# Altium project Lion-IRVT.PrjPcb (part 8 of 8)

## Sheet LionIRVT-Power.SchDoc
size A3
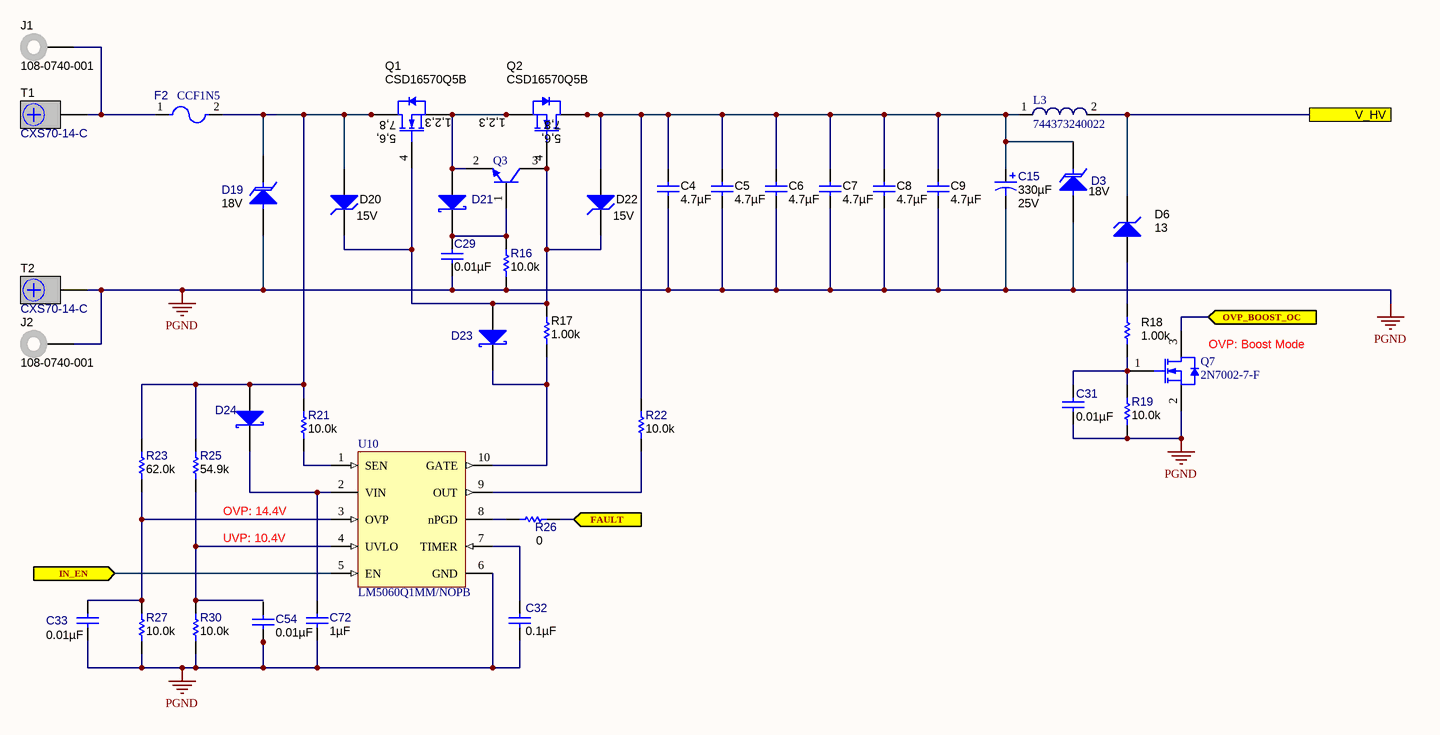
[diagram p7: LionIRVT-Power.SchDoc]

### Parts
C4  ValueDisplayed: 4.7µF  [2220_280]  (hidden comment: C5750X7R2A475M230KA)
C5  ValueDisplayed: 4.7µF  [2220_280]  (hidden comment: C5750X7R2A475M230KA)
C6  ValueDisplayed: 4.7µF  [2220_280]  (hidden comment: C5750X7R2A475M230KA)
C7  ValueDisplayed: 4.7µF  [2220_280]  (hidden comment: C5750X7R2A475M230KA)
C8  ValueDisplayed: 4.7µF  [2220_280]  (hidden comment: C5750X7R2A475M230KA)
C9  ValueDisplayed: 4.7µF  [2220_280]  (hidden comment: C5750X7R2A475M230KA)
C15  ValueDisplayed: 330µF  Value2: 25V  [CAPSMT_62_F12]  (hidden comment: 25SVPF330M)
C29  ValueDisplayed: 0.01µF  [0603C]  (hidden comment: GRM1885C1H103JA01D)
C31  ValueDisplayed: 0.01µF  [0603C]  (hidden comment: GRM1885C1H103JA01D)
C32  ValueDisplayed: 0.1µF  [0603C]  (hidden comment: C0603C104J3RACTU)
C33  ValueDisplayed: 0.01µF  [0603C]  (hidden comment: GRM1885C1H103JA01D)
C54  ValueDisplayed: 0.01µF  [0603C]  (hidden comment: GRM1885C1H103JA01D)
C72  ValueDisplayed: 1µF  [0603C]  (hidden comment: C0603C105K3RACTU)
D3  value 18V  [SMA]  (hidden comment: SMAJ18A)
D6  value 13  [sod-323]  (hidden comment: MMSZ5243BS-7-F)
D19  value 18V  [SMA]  (hidden comment: SMAJ18A)
D20  value 15V  [sod-323]  (hidden comment: MMSZ5245BS-7-F)
D21  NSR0240V2T1G  [SOD-523]  (value not drawn)
D22  value 15V  [sod-323]  (hidden comment: MMSZ5245BS-7-F)
D23  NSR0240V2T1G  [SOD-523]  (value not drawn)
D24  NSR0240V2T1G  [SOD-523]  (value not drawn)
F2  CCF1N5  [FUSE_CCF]
J1  108-0740-001  [Johnson_108-0740-001]
J2  108-0740-001  [Johnson_108-0740-001]
L3  744373240022  [WE-LHMI 4020]
Q1  CSD16570Q5B  [DNK8]
Q2  CSD16570Q5B  [DNK8]
Q3  MMBT2222ALT1G  [ONSC-SOT-23-3-318-08_V]  (value not drawn)
Q7  2N7002-7-F  [DIOD-SOT23-3_V]
R16  ValueDisplayed: 10.0k  [0603R]  (hidden comment: RC0603FR-0710KL)
R17  ValueDisplayed: 1.00k  [0603R]  (hidden comment: Resistor)
R18  ValueDisplayed: 1.00k  [0603R]  (hidden comment: Resistor)
R19  ValueDisplayed: 10.0k  [0603R]  (hidden comment: RC0603FR-0710KL)
R21  ValueDisplayed: 10.0k  [0603R]  (hidden comment: RC0603FR-0710KL)
R22  ValueDisplayed: 10.0k  [0603R]  (hidden comment: RC0603FR-0710KL)
R23  ValueDisplayed: 62.0k  [0603R]  (hidden comment: RC0603FR-0762KL)
R25  ValueDisplayed: 54.9k  [0603R]  (hidden comment: RC0603FR-0754K9L)
R26  ValueDisplayed: 0  [0603R]  (hidden comment: RC0603JR-070RL)
R27  ValueDisplayed: 10.0k  [0603R]  (hidden comment: RC0603FR-0710KL)
R30  ValueDisplayed: 10.0k  [0603R]  (hidden comment: RC0603FR-0710KL)
T1  CXS70-14-C  [Panduit_CXS70-14-C]
T2  CXS70-14-C  [Panduit_CXS70-14-C]
U10  LM5060Q1MM/NOPB  [DGS0010A_N]

### Ports
FAULT (in), IN_EN (in), OVP_BOOST_OC (in), V_HV

### Nets
PGND: C4.2 C5.2 C6.2 C7.2 C8.2 C9.2 C15.2(-) C29.2 C31.1 C32.1 C33.1 C54.1 C72.2 D3.2(A) D19.2(A) J2.1 Q7.2(S) R16.2 R19.2 R27.2 R30.2 T2.1 U10.6(GND)
V_HV: D6.1(K) L3.2 ; port V_HV
FAULT: R26.1 ; port FAULT
IN_EN: U10.5(EN) ; port IN_EN
NetC4_1: C4.1 C5.1 C6.1 C7.1 C8.1 C9.1 C15.1(+) D3.1(K) D22.2(A) L3.1 Q2.5(D) Q2.6(D) Q2.7(D) Q2.8(D) R22.1
NetC29_1: C29.1 D21.1(K) Q3.1(B) R16.1
NetC31_2: C31.2 Q7.1(G) R18.1 R19.1
NetC32_2: C32.2 U10.7(TIMER)
NetC33_2: C33.2 R23.1 R27.1 U10.3(OVP)
NetC72_1: C72.1 D24.1(K) U10.2(VIN)
NetD6_2: D6.2(A) R18.2
NetD10A_1: Q7.3(D) ; port OVP_BOOST_OC
NetD19_1: D19.1(K) D20.2(A) D24.2(A) F2.2 Q1.5(D) Q1.6(D) Q1.7(D) Q1.8(D) R21.1 R23.2 R25.2
NetD20_1: D20.1(K) D22.1(K) D23.2(A) Q1.4(G) Q2.4(G) Q3.3(C) R17.2
NetD21_2: D21.2(A) Q1.1(S) Q1.2(S) Q1.3(S) Q2.1(S) Q2.2(S) Q2.3(S) Q3.2(E)
NetD23_1: D23.1(K) R17.1 U10.10(GATE)
NetF2_1: F2.1 J1.1 T1.1
NetR21_2: R21.2 U10.1(SEN)
NetR22_2: R22.2 U10.9(OUT)
NetR25_1: R25.1 R30.1 U10.4(UVLO)
NetR26_2: R26.2 U10.8(nPGD)

Not connected (* = marked no-connect by the designer): C54 2

### Notes on the sheet
- (near Q7) OVP: Boost Mode
- (near R25) OVP: 14.4V
- UVP: 10.4V
- Title
- Size:
- Date:
- A3
- Number:
- Time:
- Revision:
- Sheet
- of
- File:
- (in symbol CSD16570Q5B) 7,8; 1,2,3; 5,6,

### Library data of the parts
C4-C9 = C5750X7R2A475M230KA: CAP, CERM, 4.7 µF, 100 V, +/- 20%, X7R, 2220; Manufacturer: TDK; Polarized: N; CompType: Capacitor; Value: 4.7uF; U/M: EA; Cap_F: 0.0000047; Tolerance_%: 20; ESR_ohm: 0.0015; Value1: 0.0015 ohm; VDC_V: 100; Value2: 100V; IRMS_A: 5.5; TaMin_C: -55; TaMax_C: 125; Cap_Case: 2220; AEC Category: Q200; SymbolVersion: 2008-07-09; PartNumber: C5750X7R2A475M230KA; PackageReference: 2220; RoHS: Y; MountType: SMT; Technology: Ceramic; TempCo: X7R; Published: 2008-06-19; Publisher: Texas Instruments; LatestRevisionDate: 2016-03-26; ComponentLink1Description: Datasheet link; ComponentLink1URL: http://www.tdk.co.jp/tefe02/e412_c.pdf; Supplier 1: Digi-Key; Supplier Part Number 1: 445-1450-1-ND; Supplier 2: Mouser; Supplier Part Number 2: 810-C5750X7R2A475M; Supplier 3: Farnell; Supplier Part Number 3: 1843193; AEC Qualified: N; AEC Grade: N/A
C15 = 25SVPF330M: CAP, Aluminum Polymer, 330 µF, 25 V, +/- 20%, 0.014 ohm, F12, SMD, 2-Leads, Body 10.5x10.5mm, Height 12.7mm SMD; Manufacturer: Panasonic; Polarized: Y; CompType: Capacitor; Value: 330uF; U/M: EA; Cap_F: 0.00033; Tolerance_%: 20; VDC_V: 25; ESR_ohm: 0.014; IRMS_A: 5; TaMin_C: -55; TaMax_C: 105; SizeAreaWB_mm2: 151.29; SizeArea_mm2: 106.09; SizeX_mm: 10.3; SizeZ_mm: 12.6; AEC Category: Q200; AEC Qualified: N; SymbolVersion: 2008-07-09; PartNumber: 25SVPF330M; PackageReference: F12, SMD, 2-Leads, Body 10.5x10.5mm, Height 12.7mm; RoHS: Y; Value1: 0.014 ohm; MountType: SMT; Technology: Aluminum Polymer; Series: SVPF; Cap_Case: F12; SizeY_mm: 10.3; Publisher: Texas Instruments; LatestRevisionDate: 2016-12-22; ComponentLink1Description: Datasheet link; ComponentLink1URL: http://industrial.panasonic.com/www-data/pdf/AAB8000/AAB8000CE1.pdf; AEC Grade: N/A
C29 C31 C33 C54 = GRM1885C1H103JA01D: CAP, CERM, 0.01 µF, 50 V, +/- 5%, C0G/NP0, 0603; Manufacturer: MuRata; Polarized: N; CompType: Capacitor; Value: 0.01uF; U/M: EA; Cap_F: 0.00000001; Tolerance_%: 5; Value1: Unknown; VDC_V: 50; Value2: 50V; TaMin_C: -55; TaMax_C: 125; Cap_Case: 0603; SizeArea_mm2: 1.28; SizeAreaWB_mm2: 4.68; SizeX_mm: 1.6; SizeY_mm: 0.8; SizeZ_mm: 1; AEC Category: Q200; SymbolVersion: 2008-07-09; PartNumber: GRM1885C1H103JA01D; PackageReference: 0603; RoHS: Y; MountType: SMT; Technology: Ceramic; TempCo: C0G/NP0; Published: 2008-06-19; Publisher: Texas Instruments; LatestRevisionDate: 2017-03-17; ComponentLink1Description: Datasheet link; ComponentLink1URL: http://search.murata.co.jp/Ceramy/image/img/A01X/G101/ENG/GRM1885C1H103JA01-01.pdf; Supplier 1: Digi-Key; Supplier Part Number 1: 490-9666-1-ND; Supplier 2: Newark; Supplier Part Number 2: 31Y1764; Supplier 3: Mouser; Supplier Part Number 3: 81-GRM1885C1H103JA1D; AEC Qualified: N; AEC Grade: N/A
C32 = C0603C104J3RACTU: CAP, CERM, 0.1 µF, 25 V, +/- 5%, X7R, 0603; Manufacturer: Kemet; Polarized: N; CompType: Capacitor; Value: 0.1uF; U/M: EA; Cap_F: 0.0000001; Tolerance_%: 5; Value1: Unknown; VDC_V: 25; Value2: 25V; TaMin_C: -55; TaMax_C: 125; Cap_Case: 0603; SizeArea_mm2: 1.28; SizeAreaWB_mm2: 4.68; SizeX_mm: 1.6; SizeY_mm: 0.8; SizeZ_mm: 1; AEC Category: Q200; SymbolVersion: 2008-07-09; PartNumber: C0603C104J3RACTU; PackageReference: 0603; RoHS: Y; MountType: SMT; Technology: Ceramic; TempCo: X7R; Published: 2008-06-19; Publisher: Texas Instruments; LatestRevisionDate: 2016-09-23; ComponentLink1Description: Datasheet link; ComponentLink1URL: http://www.kemet.com/kemet/web/homepage/kechome.nsf/vapubfiles/F3102_Y5V.pdf/$file/F3102_Y5V.pdf; Supplier 1: Digi-Key; Supplier Part Number 1: 399-1282-1-ND; Supplier 2: Mouser; Supplier Part Number 2: 80-C0603C104J3R; Supplier 3: Farnell; Supplier Part Number 3: 1650833; AEC Qualified: ?
C72 = C0603C105K3RACTU: CAP, CERM, 1 µF, 25 V, +/- 10%, X7R, 0603; Manufacturer: Kemet; Polarized: N; CompType: Capacitor; Value: 1uF; U/M: EA; Cap_F: 0.000001; Tolerance_%: 10; Value1: Unknown; VDC_V: 25; Value2: 25V; TaMin_C: -55; TaMax_C: 125; Cap_Case: 0603; SizeArea_mm2: 1.28; SizeAreaWB_mm2: 4.68; SizeX_mm: 1.6; SizeY_mm: 0.8; SizeZ_mm: 1; AEC Category: Q200; SymbolVersion: 2008-07-09; PartNumber: C0603C105K3RACTU; PackageReference: 0603; RoHS: Y; MountType: SMT; Technology: Ceramic; TempCo: X7R; Published: 2008-06-19; Publisher: Texas Instruments; LatestRevisionDate: 2016-09-23; ComponentLink1Description: Datasheet link; ComponentLink1URL: http://capacitoredge.kemet.com/capedge2/DataSheet/Datasheet-C0603C105K3RACTU.pdf?pn=C0603C105K3RACTU; Supplier 1: Digi-Key; Supplier Part Number 1: 399-7376-1-ND; Supplier 2: Mouser; Supplier Part Number 2: 80-C0603C105K3R; Supplier 3: Farnell; Supplier Part Number 3: 2118128; AEC Qualified: ?
D3 D19 = SMAJ18A: Diode, TVS, Uni, 18 V, 29.2 Vc, SMA; Manufacturer: Littelfuse; U/M: EA; Value1: 3.3W; Vr_V: 18; Power_W: 3.3; RJA_CperW: 120; AEC Category: Q101; AEC Qualified: N; SizeAreaWB_mm2: 37.3428; SizeArea_mm2: 16.3228; SizeX_mm: 5.59; SizeY_mm: 2.92; SizeZ_mm: 2.87; CompType: TVS; SymbolVersion: 2012-01-13; PartNumber: SMAJ18A; PackageReference: SMA; MountType: SMT; RoHS: Y; Published: 2008-10-08; Publisher: Texas Instruments; LatestRevisionDate: 2016-12-21; ComponentLink1Description: Datasheet link; ComponentLink1URL: http://www.littelfuse.com/~/media/electronics/datasheets/tvs_diodes/littelfuse_tvs_diode_smaj_datasheet.pdf.pdf; Supplier 1: Digi-Key; Supplier Part Number 1: SMAJ18ALFCT-ND; Supplier 2: Mouser; Supplier Part Number 2: 576-SMAJ18A; Supplier 3: Farnell; Supplier Part Number 3: 1787557; Vz_V: N/A; LatestRevisionNote: Updated Supplier Data
D6 = MMSZ5243BS-7-F: Diode, Zener, 13V, 200mW, SOD-323; Manufacturer: Diodes Inc.; U/M: EA; Power_W: 0.2; Value1: 0.2W; RJA_CperW: 350; CompType: Zener; SymbolVersion: 2010-08-25; PartNumber: MMSZ5243BS-7-F; PackageReference: SOD-323; Vr_V: N/A; Vz_V: 13; MountType: SMT; RoHS: Y; ComponentLink1Description: Datasheet link; ComponentLink1URL: http://www.diodes.com/datasheets/ds31038.pdf; Published: 2008-10-08; Publisher: Texas Instruments; LatestRevisionDate: 2013-07-05; LatestRevisionNote: Updated Supplier Data
D20 D22 = MMSZ5245BS-7-F: Diode, Zener, 15 V, 200 mW, SOD-323; Manufacturer: Diodes Inc.; SymbolCreator: a0412235; U/M: EA; Power_W: 0.2; Vz_V: 15; Value1: 0.2W; RJA_CperW: 350; SizeAreaWB_mm2: 8.695; SizeArea_mm2: 3.645; SizeX_mm: 2.7; SizeY_mm: 1.35; SizeZ_mm: 1; AEC Category: Q101; SymbolVersion: 2010-08-25; PartNumber: MMSZ5245BS-7-F; PackageReference: SOD-323; CompType: Zener; Vr_V: N/A; MountType: SMT; RoHS: Y; ComponentLink1Description: Datasheet link; ComponentLink1URL: http://www.diodes.com/datasheets/ds31038.pdf; Published: 2008-10-08; Publisher: Texas Instruments; LatestRevisionDate: 2017-03-18; LatestRevisionNote: Updated Supplier Data; Supplier 1: Digi-Key; Supplier Part Number 1: MMSZ5245BS-FDICT-ND; Supplier 2: Mouser; Supplier Part Number 2: 621-MMSZ5245BS-F; AEC Qualified: ?
D21 D23 D24 = NSR0240V2T1G: Diode, Schottky, 40V, 0.25A, SOD-523; Manufacturer: ON Semiconductor; U/M: EA; Vf_V: 0.7; Value2: 0.7V; Io_A: 0.25; Vr_V: 40; TJmax_C: 150; RJC_CperW: 600; CompType: Diode; SymbolVersion: 2008-12-08; PartNumber: NSR0240V2T1G; PackageReference: SOD-523; Value: 40V; Value1: 0.25A; MountType: SMT; Type: Schottky; RoHS: Y; Published: 2008-06-26; Publisher: Texas Instruments; LatestRevisionDate: 2014-07-21; ComponentLink1Description: Datasheet link; ComponentLink1URL: http://www.onsemi.com/pub_link/Collateral/NSR0240V2T1-D.PDF; Supplier 1: Digi-Key; Supplier Part Number 1: NSR0240V2T1GOSCT-ND; Supplier 2: Mouser; Supplier Part Number 2: 863-NSR0240V2T1G; Supplier 3: Newark; Supplier Part Number 3: 46P8323
F2 = FUSE_CCF1N_SERIES: Fuse, Fast Acting, 50VDC, 20A; Manufacturer: Koanet; Area: 46035; Value: LH-10; ComponentLink1URL: \\vette02\pmp_pcb\pcad_pdf's\ccf_fuse.pdf; ComponentHeight: 0.098 inch; PackageReference: 0.98 x 0.236 inch; SymbolVersion: 07/31/2009 12:17:29; PartNumber: CCF1N5; ComponentLink1Description: AEO Datasheet Link
J1 J2 = 108-0740-001: Standard Banana Jack, Uninsulated, 15A; Manufacturer: Emerson Network Power; SymbolCreator: a0412235; CompType: Connector; U/M: EA; SymbolVersion: 2009-09-23; PartNumber: 108-0740-001; PackageReference: Banana Jack; RoHS: Y; MountType: TH; ComponentLink1Description: Datasheet Link; ComponentLink1URL: http://emersonnetworkpower.com/webapp/wcs/stores/servlet/ESC/resources/1080740001.pdf; Publisher: Texas Instruments; LatestRevisionDate: 2014-11-22; Supplier 1: Digi-Key; Supplier Part Number 1: J147-ND; Supplier 2: Mouser; Supplier Part Number 2: 530-108-0740-1
L3 = CMP-1353-00034-1: SMD Power Inductor WE-LHMI, L=0.22 µH; Manufacturer: Wuerth Elektronik; Inductance: 0.22 ÂµH; ComponentLink1URL: http://www.we-online.com; ComponentLink2Description: Datasheet; PartNumber: 744373240022; PackageReference: WE-LHMI 4020; ComponentLink2URL: http://katalog.we-online.de/kataloge/eisos/media/pdf/744373240022.pdf; ComponentLink1Description: Manufacturer URL
Q1 Q2 = CSD16570Q5B: 25V, N ch NexFET MOSFET™, single SON5x6, 0.82mOhm; Manufacturer: Texas Instruments; Manufacturer Part Number: CSD16570Q5BT; CompType: MOSFET; Continuous Drain Current (ID): 100A; Rds On Max: 0.59mR; Input Capacitance: 14nF; Max Power Dissipation: 195W; Gate to Source Voltage (Vgs): 20V; Fall Time: 72ns; Rise Time: 43ns; Turn-Off Delay Time: 156ns; Turn-On Delay Time: 5ns; Threshold Voltage: 1.5V; Number of Channels: 1; SymbolVersion: 2008-07-09; Value: 25V; PartNumber: CSD16570Q5B; PackageReference: DNK0008A; ComponentLink1Description: Datasheet link; ComponentLink1URL: http://www.ti.com/lit/ds/symlink/csd17308q3.pdf; Supplier 1: Digi-Key; RoHS: Yes; Category: MOSFETs; Stock 1: 3774; Pricing 1: 1=2.43000, 10=2.18600, 25=2.06240, 100=1.60880 (USD); Mount: Surface Mount; Number of Pins: 8; Weight: 0.000847oz; Contact Plating: Gold; Min Operating Temperature: -55°C; Max Operating Temperature: 150°C; Packaging: Tape and Reel; Drain to Source Voltage (Vdss): 25V; Element Configuration: Single; Drain to Source Breakdown Voltage: 25V; Package Quantity: 250; Lead Free: Contains Lead; REACH SVHC: No SVHC; ComponentLink2URL: http://www.farnell.com/datasheets/1874868.pdf?src-supplier=Farnell; ComponentLink2Description: http://www.farnell.com/datasheets/1874868.pdf?src-supplier=Farnell; ComponentLink3URL: http://www.farnell.com/datasheets/2026550.pdf?src-supplier=Element14; ComponentLink3Description: http://www.farnell.com/datasheets/2026550.pdf?src-supplier=Element14; ComponentLink4URL: http://www.ti.com/lit/ds/symlink/csd16570q5b.pdf?src-supplier=Digi-Key; ComponentLink4Description: http://www.ti.com/lit/ds/symlink/csd16570q5b.pdf?src-supplier=Digi-Key; ComponentLink5URL: http://www.ti.com/general/docs/lit/getliterature.tsp?genericPartNumber=CSD16570Q5B&fileType=pdf&src-supplier=Farnell; ComponentLink5Description: http://www.ti.com/general/docs/lit/getliterature.tsp?genericPartNumber=CSD16570Q5B&fileType=pdf&src-supplier=Farnell; ComponentLink6URL: http://www.ti.com/general/docs/lit/getliterature.tsp?genericPartNumber=CSD16570Q5B&&fileType=pdf&src-supplier=Avnet; ComponentLink6Description: http://www.ti.com/general/docs/lit/getliterature.tsp?genericPartNumber=CSD16570Q5B&&fileType=pdf&src-supplier=Avnet; ComponentLink7URL: http://www.farnell.com/datasheets/1874868.pdf?src-supplier=Element14; ComponentLink7Description: http://www.farnell.com/datasheets/1874868.pdf?src-supplier=Element14; ComponentLink8URL: http://www.ti.com/lit/gpn/csd16570q5b?src-supplier=Mouser; ComponentLink8Description: http://www.ti.com/lit/gpn/csd16570q5b?src-supplier=Mouser; Supplier Part Number 1: 296-38335-1-ND
Q3 = CMP-1048-00538-1: General Purpose Transistor, NPN Silicon, 3-Pin SOT-23, Pb-Free, Tape and Reel; Manufacturer: On Semiconductor; fT Min (MHz): 300; IC Continuous (A): 0.6; ComponentLink3URL: http://www.onsemi.cn/pub_link/Collateral/318-08.PDF; PartNumber: MMBT2222ALT1G; RoHS: TRUE; ComponentLink1URL: http://www.onsemi.com/; ComponentLink3Description: Package Specification; ComponentLink2Description: Datasheet; Mounting Technology: Surface Mount; Packing: Tape and Reel; PackageDescription: 3-Pin Small Outline Transistor, Body 2.92 x 1.3 mm, Pitch 0.95 mm; DatasheetVersion: Rev. 10; PackageReference: SOT-23-3-318-08; ComponentLink2URL: http://www.onsemi.cn/pub_link/Collateral/MMBT2222LT1-D.PDF; Polarity: NPN; PackageVersion: Rev. AP, 11/2009; ComponentLink1Description: Manufacturer URL
Q7 = CMP-2000-04929-1: N-Channel Enhancement Mode Field Effect Transistor, 60 V, 0.115 A, -55 to 150 degC, 3-Pin SOT23, RoHS, Tape and Reel; Id - Continuous Drain Current: 115mA; Typical Turn-On Delay Time: 7ns; Typical Turn-Off Delay Time: 11ns; Brand: DiodesIncorporated; Transistor Type: 1N-Channel; Vgs - Gate-Source Voltage: 20V; Rise Time: 3ns; Configuration: Single; Fall Time: 5.6ns; Vds - Drain-Source Breakdown Voltage: 70V; Rds On - Drain-Source Resistance: 7.5Ohms; Number of Channels: 1Channel; Forward Transconductance - Min: 0.08S; Pd - Power Dissipation: 300mW; Unit Weight: 0.000282oz; Datasheet URL: http://datasheet.octopart.com/2N7002-7-F-Diodes-Inc.-datasheet-8326113.pdf; Width: 1.3mm; Series: 2N7002; Length: 2.9mm; Product Category: MOSFET; Minimum Operating Temperature: -55C; Manufacturer URL: http://www.diodes.com/; Mounting Style: SMD/SMT; Package Reference: SOT23-3; Package Description: 3-Pin Small Outline Transistor, Body 2.9 x 1.3 mm, Pitch 0.96 mm; Maximum Operating Temperature: +150C; Transistor Polarity: N-Channel; Factory Pack Quantity: 3000; Technology: Si; Channel Mode: Enhancement; Datasheet Version: Rev. 21-2, 02/2009; Type: EnhancementModeFieldEffectTransistor; RoHS: True; Packaging: Reel; Package / Case: SOT-23-3; Height: 1mm; Product: MOSFETSmallSignal; Manufacturer: DiodesIncorporated
R16 R19 R21 R22 R27 R30 = RC0603FR-0710KL: RES, 10.0 k, 1%, 0.1 W, 0603; Manufacturer: Yageo America; CompType: Resistor; Value: 10.0k; Res_ohm: 10000; Value_Code: 10k0; Tolerance_%: 1; Power_W: 0.1; Value2: 0.1W; VDC_V: 150; TempCo: 200 ppm/C; SizeArea_mm2: 1.28; SizeX_mm: 1.6; SizeY_mm: 0.8; EIA_Code: E96; U/M: EA; AEC Category: Q200; SymbolVersion: 2009-05-29; PartNumber: RC0603FR-0710KL; PackageReference: 0603; RoHS: Y; Value1: 1%; MountType: SMT; Technology: Thick Film; SizeZ_mm: 1; Published: 2008-06-26; Publisher: Texas Instruments; LatestRevisionDate: 2017-03-04; ComponentLink1Description: Datasheet link; ComponentLink1URL: http://www.yageo.com/pdf/Pu-RC0603_51_PbFree_L_2.pdf; Supplier 1: Digi-Key; Supplier Part Number 1: 311-10.0KHRCT-ND; Supplier 2: Mouser; Supplier Part Number 2: 603-RC0603FR-0710KL; Supplier 3: Farnell; Supplier Part Number 3: 9238603; AEC Qualified: ?
R17 R18 = CMP-0022109-5: RES, 1.00 k, 1%, 0.1 W, AEC-Q200 Grade 0, 0603; PartNumber: CRCW06031K00FKEA; Manufacturer: Vishay-Dale; Value: 1.00k; Res_ohm: 1k; Value_Code: 1k00; Power_W: 100mW; Value2: 0.1W; VDC_V: 75V; TempCo: 100 ppm/C; EIA_Code: E96; AEC Category: Q200; AEC Qualified: Y; AEC Grade: 0; SizeArea_mm2: 1.28; SizeX_mm: 1.6; SizeY_mm: 0.8; SizeZ_mm: 1; CompType: Resistor; PackageReference: 0603; RoHS: E; Tolerance_%: 1%; Value1: 1%; MountType: SMT; Technology: Thick Film; ComponentLink1Description: Datasheet link; ComponentLink1URL: http://www.vishay.com/docs/20035/dcrcwe3.pdf; Supplier 1: Digi-Key; Supplier Part Number 1: 541-1.00KHCT-ND; Supplier 2: Newark; Supplier Part Number 2: 52K8015; Supplier 3: Mouser; Supplier Part Number 3: 71-CRCW0603-1.0K-E3
R23 = RC0603FR-0762KL: RES, 62.0 k, 1%, 0.1 W, 0603; Manufacturer: Yageo America; CompType: Resistor; Value: 62.0k; Res_ohm: 62000; Value_Code: 62k0; Tolerance_%: 1; Power_W: 0.1; Value2: 0.1W; VDC_V: 150; TempCo: 200 ppm/C; SizeArea_mm2: 1.28; SizeX_mm: 1.6; SizeY_mm: 0.8; U/M: EA; AEC Category: Q200; SymbolVersion: 2009-05-29; PartNumber: RC0603FR-0762KL; PackageReference: 0603; RoHS: Y; Value1: 1%; MountType: SMT; Technology: Thick Film; SizeZ_mm: 1; Published: 2008-06-26; Publisher: Texas Instruments; LatestRevisionDate: 2016-09-18; ComponentLink1Description: Datasheet link; ComponentLink1URL: http://www.yageo.com/pdf/Pu-RC0603_51_PbFree_L_2.pdf; Supplier 1: Digi-Key; Supplier Part Number 1: 311-62.0KHRCT-ND; Supplier 2: Mouser; Supplier Part Number 2: 603-RC0603FR-0762KL; AEC Qualified: ?
R25 = RC0603FR-0754K9L: RES, 54.9 k, 1%, 0.1 W, 0603; Manufacturer: Yageo America; CompType: Resistor; Value: 54.9k; Res_ohm: 54900; Value_Code: 54k9; Tolerance_%: 1; Power_W: 0.1; Value2: 0.1W; VDC_V: 150; TempCo: 200 ppm/C; SizeArea_mm2: 1.28; SizeX_mm: 1.6; SizeY_mm: 0.8; EIA_Code: E96; U/M: EA; AEC Category: Q200; SymbolVersion: 2009-05-29; PartNumber: RC0603FR-0754K9L; PackageReference: 0603; RoHS: Y; Value1: 1%; MountType: SMT; Technology: Thick Film; SizeZ_mm: 1; Published: 2008-06-26; Publisher: Texas Instruments; LatestRevisionDate: 2016-09-18; ComponentLink1Description: Datasheet link; ComponentLink1URL: http://www.yageo.com/pdf/Pu-RC0603_51_PbFree_L_2.pdf; Supplier 1: Digi-Key; Supplier Part Number 1: 311-54.9KHRCT-ND; Supplier 2: Mouser; Supplier Part Number 2: 603-RC0603FR-0754K9L; AEC Qualified: ?
R26 = RC0603JR-070RL: RES, 0, 5%, 0.1 W, 0603; Manufacturer: Yageo America; CompType: Resistor; Value: 0; Value_Code: 0000; Tolerance_%: 5; Power_W: 0.1; Value2: 0.1W; VDC_V: 50; TempCo: 200 ppm/C; SizeArea_mm2: 1.28; SizeX_mm: 1.6; SizeY_mm: 0.8; SizeZ_mm: 1; EIA_Code: E24; U/M: EA; AEC Category: Q200; SymbolVersion: 2009-05-29; PartNumber: RC0603JR-070RL; PackageReference: 0603; RoHS: Y; Res_ohm: 0; Value1: 5%; MountType: SMT; Technology: Thick Film; Published: 2008-06-26; Publisher: Texas Instruments; LatestRevisionDate: 2016-09-18; ComponentLink1Description: Datasheet link; ComponentLink1URL: http://www.yageo.com/pdf/Pu-RC0603_51_PbFree_L_2.pdf; Supplier 1: Digi-Key; Supplier Part Number 1: 311-0.0GRCT-ND; Supplier 2: Mouser; Supplier Part Number 2: 603-RC0603JR-070RL; Supplier 3: Farnell; Supplier Part Number 3: 9233130; AEC Qualified: ?
T1 T2 = CXS70-14-C: Terminal 70A Lug; Manufacturer: Panduit; SymbolCreator: crossc; CompType: Screw Terminal; U/M: EA; SymbolVersion: 2009-10-14; PartNumber: CXS70-14-C; PackageReference: LUG, 32.3x14.5x11.7; RoHS: Y; MountType: TH; ComponentLink1Description: Datasheet Link; ComponentLink1URL: http://www.panduit.com/heiler/PartDrawings/C-PCCXS70-14-C--ENG.pdf; Publisher: Texas Instruments; LatestRevisionDate: 2014-11-22; Supplier 1: Digi-Key; Supplier Part Number 1: CXS70-14-C-ND; Supplier 2: Mouser; Supplier Part Number 2: 644-CXS70-14-C
U10 = CMP-0069-01835-4: High-Side Protection Controller with Low Quiescent Current, 10-pin MSOP, Pb-Free; Manufacturer: Texas Instruments; PackageTopMarking: ZXTT*SZAB; CompType: Switcher; High-Reliability: Y; PackageDescription: Mini-SO, Molded, .118 x .118 x .034in Body, 10 Lead, .0197in Pitch; PartNumber: LM5060Q1MM/NOPB; ComponentLink1URL: http://www.ti.com/general/docs/lit/getliterature.tsp?genericPartNumber=LM5060-Q1&fileType=pdf; Code_JEDEC: MO-187-BA; PackageReference: DGS0010A; PinCount: 10; RoHS: Y; PowerWise: Y; ComponentLink1Description: Datasheet URL

## Sheet LionIRVT-TM4C_Power.SchDoc
size A4; Date: Not shown in title block; ApprovedBy: Not shown in title block; CheckedBy: Not shown in title block; Author: Not shown in title block; CompanyName: Not shown in title block; Engineer: Not shown in title block; Organization: Not shown in title block; Address1: Not shown in title block; Address2: Not shown in title block; Address3: Not shown in title block; Address4: Not shown in title block; DocumentNumber: 11; Revision: Use project parameter SCH_Rev; SheetNumber: 11; SheetTotal: 11; PageSetup: Record=PageOptions|CenterHorizontal=True|CenterVertical=True|PrintScale=1.00|XCorrection=1.00|YCorrection=1.00|PrintKind=0|BorderSize=5000000|LeftOffset=0|BottomOffset=0|Orientation=2|PaperLength=1000|PaperWidth=1000|Scale=100|PaperSource=15|PrintQuality=600|MediaType=1|DitherType=10|PaperKind=Letter|PrintScaleMode=1; CurrentTime: Not shown in title block; CurrentDate: Not shown in title block; Time: Not shown in title block; DocumentFullPathAndName: Not shown in title block; DocumentName: Not shown in title block; ModifiedDate: Not shown in title block; ImagePath: Not shown in title block
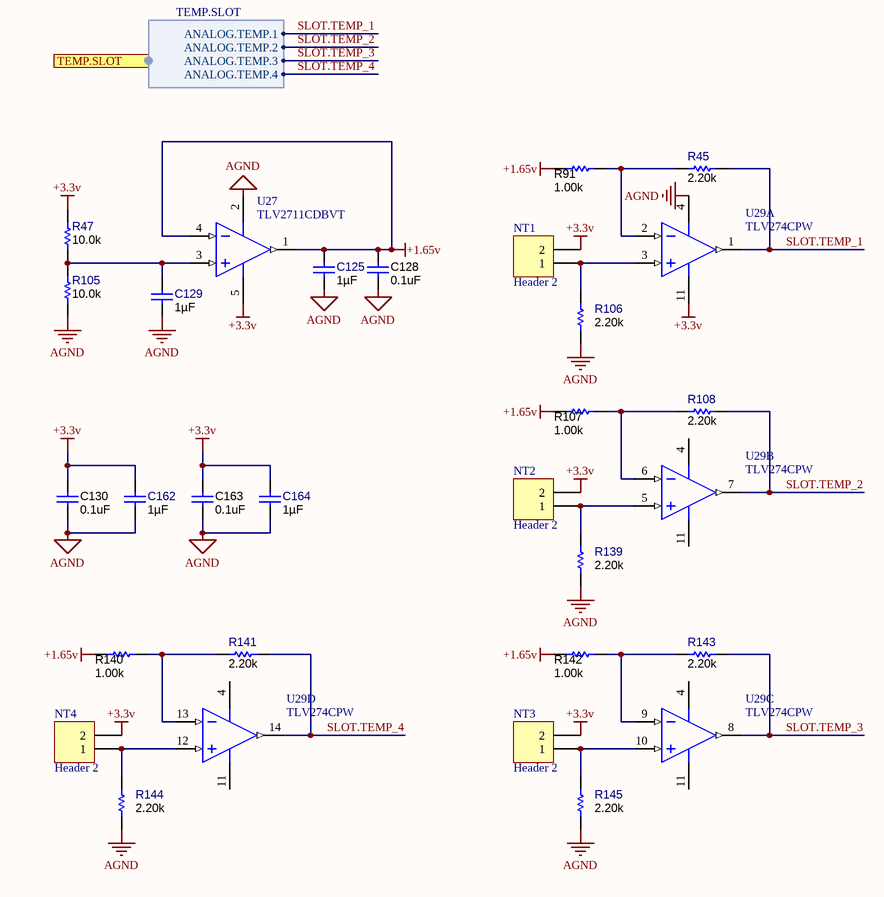
[diagram p8: LionIRVT-TM4C_Power.SchDoc]

### Parts
C125  ValueDisplayed: 1µF  [0603C]  (hidden comment: C0603C105K3RACTU)
C128  ValueDisplayed: 0.1uF  [0603C]  (hidden comment: Capacitor)
C129  ValueDisplayed: 1µF  [0603C]  (hidden comment: C0603C105K3RACTU)
C130  ValueDisplayed: 0.1uF  [0603C]  (hidden comment: Capacitor)
C162  ValueDisplayed: 1µF  [0603C]  (hidden comment: C0603C105K3RACTU)
C163  ValueDisplayed: 0.1uF  [0603C]  (hidden comment: Capacitor)
C164  ValueDisplayed: 1µF  [0603C]  (hidden comment: C0603C105K3RACTU)
NT1  Header 2  [HDR1X2]
NT2  Header 2  [HDR1X2]
NT3  Header 2  [HDR1X2]
NT4  Header 2  [HDR1X2]
R45  ValueDisplayed: 2.20k  [0603R]  (hidden comment: RC0603FR-072K2L)
R47  ValueDisplayed: 10.0k  [0603R]  (hidden comment: RC0603FR-0710KL)
R91  ValueDisplayed: 1.00k  [0603R]  (hidden comment: Resistor)
R105  ValueDisplayed: 10.0k  [0603R]  (hidden comment: RC0603FR-0710KL)
R106  ValueDisplayed: 2.20k  [0603R]  (hidden comment: RC0603FR-072K2L)
R107  ValueDisplayed: 1.00k  [0603R]  (hidden comment: Resistor)
R108  ValueDisplayed: 2.20k  [0603R]  (hidden comment: RC0603FR-072K2L)
R139  ValueDisplayed: 2.20k  [0603R]  (hidden comment: RC0603FR-072K2L)
R140  ValueDisplayed: 1.00k  [0603R]  (hidden comment: Resistor)
R141  ValueDisplayed: 2.20k  [0603R]  (hidden comment: RC0603FR-072K2L)
R142  ValueDisplayed: 1.00k  [0603R]  (hidden comment: Resistor)
R143  ValueDisplayed: 2.20k  [0603R]  (hidden comment: RC0603FR-072K2L)
R144  ValueDisplayed: 2.20k  [0603R]  (hidden comment: RC0603FR-072K2L)
R145  ValueDisplayed: 2.20k  [0603R]  (hidden comment: RC0603FR-072K2L)
U27  TLV2711CDBVT  [DBV0005A_M]
U29  TLV274CPW  [PW0014A_M]  (parts A,B,C,D of 4)

### Ports
TEMP.SLOT (harness TEMP.SLOT)

### Harnesses
TEMP.SLOT: ANALOG.TEMP.1, ANALOG.TEMP.2, ANALOG.TEMP.3, ANALOG.TEMP.4

### Nets
+1.65v: C125.2 C128.1 R91.2 R107.2 R140.2 R142.2 U27.1(OUT) U27.4(IN-)
+3.3v: C130.1 C162.2 C163.1 C164.2 NT1.2 NT2.2 NT3.2 NT4.2 R47.1 U27.5(VDD-/GND) U29.11(GND)
AGND: C125.1 C128.2 C129.1 C130.2 C162.1 C163.2 C164.1 R105.2 R106.1 R139.1 R144.1 R145.1 U27.2(VDD+) U29.4(VDD)
SLOT.TEMP_1: R45.1 U29.1(OUT1) ; port TEMP.SLOT.ANALOG.TEMP.1
SLOT.TEMP_2: R108.1 U29.7(OUT2) ; port TEMP.SLOT.ANALOG.TEMP.2
SLOT.TEMP_3: R143.1 U29.8(OUT3) ; port TEMP.SLOT.ANALOG.TEMP.3
SLOT.TEMP_4: R141.1 U29.14(OUT4) ; port TEMP.SLOT.ANALOG.TEMP.4
NetC129_2: C129.2 R47.2 R105.1 U27.3(IN+)
NetNT1_1: NT1.1 R106.2 U29.3(IN1+)
NetNT2_1: NT2.1 R139.2 U29.5(IN2+)
NetNT3_1: NT3.1 R145.2 U29.10(IN3+)
NetNT4_1: NT4.1 R144.2 U29.12(IN4+)
NetR45_2: R45.2 R91.1 U29.2(IN1-)
NetR107_1: R107.1 R108.2 U29.6(IN2-)
NetR140_1: R140.1 R141.2 U29.13(IN4-)
NetR142_1: R142.1 R143.2 U29.9(IN3-)

### Notes on the sheet
- Title
- Size:
- Date:
- A4
- Number:
- Time:
- Revision:
- Sheet
- of
- File:

### Library data of the parts
C125 C129 C162 C164 = C0603C105K3RACTU: as C72 on sheet LionIRVT-Power; SymbolVersion: 2008-07-09; PartNumber: C0603C105K3RACTU; PackageReference: 0603; RoHS: Y; MountType: SMT; Technology: Ceramic; TempCo: X7R; Published: 2008-06-19; Publisher: Texas Instruments; LatestRevisionDate: 2016-09-23; ComponentLink1Description: Datasheet link; ComponentLink1URL: http://capacitoredge.kemet.com/capedge2/DataSheet/Datasheet-C0603C105K3RACTU.pdf?pn=C0603C105K3RACTU; Supplier 1: Digi-Key; Supplier Part Number 1: 399-7376-1-ND; Supplier 2: Mouser; Supplier Part Number 2: 80-C0603C105K3R; Supplier 3: Farnell; Supplier Part Number 3: 2118128; AEC Qualified: ?
C128 C130 C163 = CMP-0006752-5: CAP, CERM, 0.1 uF, 25 V, +/- 5%, X7R, 0603; PartNumber: 06033C104JAT2A; Manufacturer: AVX; Polarized: N; Value: 0.1uF; U/M: EA; Cap_F: 100nF; ESR_ohm: 0.05; Value1: 0.05 ohm; VDC_V: 25V; TaMin_C: -55°C; TaMax_C: 125°C; Cap_Case: 0603; AEC Category: Q200; SizeArea_mm2: 1.28; SizeAreaWB_mm2: 4.68; SizeX_mm: 1.6; SizeY_mm: 0.8; SizeZ_mm: 1; CompType: Capacitor; PackageReference: 0603; RoHS: Y; Tolerance_%: 5%; Value2: 25V; MountType: SMT; Technology: Ceramic; TempCo: X7R; Published: 2008-06-19; Publisher: Texas Instruments; LatestRevisionDate: 2017-03-09; ComponentLink1Description: Datasheet link; ComponentLink1URL: http://datasheets.avx.com/X7RDielectric.pdf; Supplier 1: Digi-Key; Supplier Part Number 1: 478-3713-1-ND; Supplier 2: Mouser; Supplier Part Number 2: 581-06033C104JAT2A; Supplier 3: Farnell; Supplier Part Number 3: 1740614; AEC Qualified: N; AEC Grade: N/A
NT1-NT4 = Header 2: Header, 2-Pin; LatestRevisionDate: 17-Jul-2002; LatestRevisionNote: Re-released for DXP Platform.; Publisher: Altium Limited
R45 R106 R108 R139 R141 R143-R145 = RC0603FR-072K2L: RES, 2.20 k, 1%, 0.1 W, 0603; Manufacturer: Yageo America; CompType: Resistor; Value: 2.20k; Res_ohm: 2200; Value_Code: 2k20; Tolerance_%: 1; Power_W: 0.1; Value2: 0.1W; VDC_V: 150; TempCo: 200 ppm/C; SizeArea_mm2: 1.28; SizeX_mm: 1.6; SizeY_mm: 0.8; U/M: EA; AEC Category: Q200; SymbolVersion: 2009-05-29; PartNumber: RC0603FR-072K2L; PackageReference: 0603; RoHS: Y; Value1: 1%; MountType: SMT; Technology: Thick Film; SizeZ_mm: 1; Published: 2008-06-26; Publisher: Texas Instruments; LatestRevisionDate: 2017-03-04; ComponentLink1Description: Datasheet link; ComponentLink1URL: http://www.yageo.com/pdf/Pu-RC0603_51_PbFree_L_2.pdf; Supplier 1: Digi-Key; Supplier Part Number 1: 311-2.20KHRCT-ND; Supplier 2: Mouser; Supplier Part Number 2: 603-RC0603FR-072K2L; Supplier 3: Farnell; Supplier Part Number 3: 9238522; AEC Qualified: ?
R47 R105 = RC0603FR-0710KL: as R16 on sheet LionIRVT-Power; SymbolVersion: 2009-05-29; PartNumber: RC0603FR-0710KL; PackageReference: 0603; RoHS: Y; Value1: 1%; MountType: SMT; Technology: Thick Film; SizeZ_mm: 1; Published: 2008-06-26; Publisher: Texas Instruments; LatestRevisionDate: 2017-03-04; ComponentLink1Description: Datasheet link; ComponentLink1URL: http://www.yageo.com/pdf/Pu-RC0603_51_PbFree_L_2.pdf; Supplier 1: Digi-Key; Supplier Part Number 1: 311-10.0KHRCT-ND; Supplier 2: Mouser; Supplier Part Number 2: 603-RC0603FR-0710KL; Supplier 3: Farnell; Supplier Part Number 3: 9238603; AEC Qualified: ?
R91 R107 R140 R142 = CMP-0022109-5: as R17 on sheet LionIRVT-Power; CompType: Resistor; PackageReference: 0603; RoHS: E; Tolerance_%: 1%; Value1: 1%; MountType: SMT; Technology: Thick Film; ComponentLink1Description: Datasheet link; ComponentLink1URL: http://www.vishay.com/docs/20035/dcrcwe3.pdf; Supplier 1: Digi-Key; Supplier Part Number 1: 541-1.00KHCT-ND; Supplier 2: Newark; Supplier Part Number 2: 52K8015; Supplier 3: Mouser; Supplier Part Number 3: 71-CRCW0603-1.0K-E3
U27 = CMP-0271-00232-3: Single LinCMOS(TM) Rail-to-Rail uPower Operational Amplifier, 2.7 to 10 V, 0 to 70 degC, 5-pin SOT23 (DBV5), Green (RoHS & no Sb/Br); Manufacturer: Texas Instruments; Sub Family: Low Power Amp (<=500uA), Low Supply Voltage Amplifier (<=2.7V), Precision Amplifier; Total Supply Voltage(Min)(+5V is 5, +/-5V is 10): 2.7; Total Supply Voltage(Max)(+5V is 5, +/-5V is 10): 10; Slew Rate(Typ)(V/us): 0.025; Vio (25C)(Max)(mV): 3; IIB(Max)(pA): 60; Offset Drift(Typ)(uV/C): 1; CMRR(Min)(dB): 65; Vn at 1kHz(Typ)(nV/rtHz): 22; PackageVersion: 4073253-4/K, 03/2006; PackageDescription: 5-Pin Plastic Small Outline, Body 1.6 x 2.9 mm, Pitch 0.95 mm; DatasheetVersion: SLOS196A; ComponentLink3URL: http://www.ti.com/litv/pdf/mpds018i; Eco-Plan: Green (RoHS & no Sb/Br); ComponentLink2Description: Datasheet; ComponentLink2URL: http://www.ti.com/general/docs/lit/getliterature.tsp?genericPartNumber=TLV2711&fileType=pdf; PartNumber: TLV2711CDBVT; PackageReference: DBV0005A; Code_JEDEC: MO-178; Mounting Technology: Surface Mount; Iq per channel(Max)(mA): 0.025; ComponentLink1Description: Manufacturer URL; ComponentLink3Description: Package Specification; Number of Channels: 1; ComponentLink1URL: http://www.ti.com/
U29 = CMP-0272-04009-3: 550 uA/Ch, 3 MHz, Rail-to-Rail Output Operational Amplifier, 2.7 to 16 V, 0 to 70 degC, 14-pin SOP (PW14), Green (RoHS & no Sb/Br); Manufacturer: Texas Instruments; IIB(Max)(pA): 60; Total Supply Voltage(Min)(+5V is 5, +/-5V is 10): 2.7; Packing: TUBE; Offset Drift(Typ)(uV/C): 2; Slew Rate(Typ)(V/us): 2.4; Rating: Catalog; Iq per channel(Max)(mA): 0.55; Vio (25C)(Max)(mV): 5; GBW(Typ)(MHz): 3; CMRR(Min)(dB): 69; Sub Family: Low Supply Voltage Amplifier (<=2.7V), Precision Amplifier; Total Supply Voltage(Max)(+5V is 5, +/-5V is 10): 16; Number of Channels: 4; ComponentLink3URL: http://www.ti.com/litv/pdf/mpds360; PackageReference: PW0014A; Eco-Plan: Green (RoHS & no Sb/Br); DatasheetVersion: SLOS351D; PartNumber: TLV274CPW; Mounting Technology: Surface Mount; Code_JEDEC: MO-153; ComponentLink2Description: Datasheet; ComponentLink1Description: Manufacturer URL; PackageDescription: 14-Pin Plastic Small Outline, Body 5 x 4.4 mm, Pitch 0.65 mm; ComponentLink1URL: http://www.ti.com/; ComponentLink3Description: Package Specification; ComponentLink2URL: http://www.ti.com/lit/ds/symlink/tlv274.pdf; PackageVersion: 4040064-3/G, 02/2011

## Sheet LionIRVT-HW.SchDoc
size A4
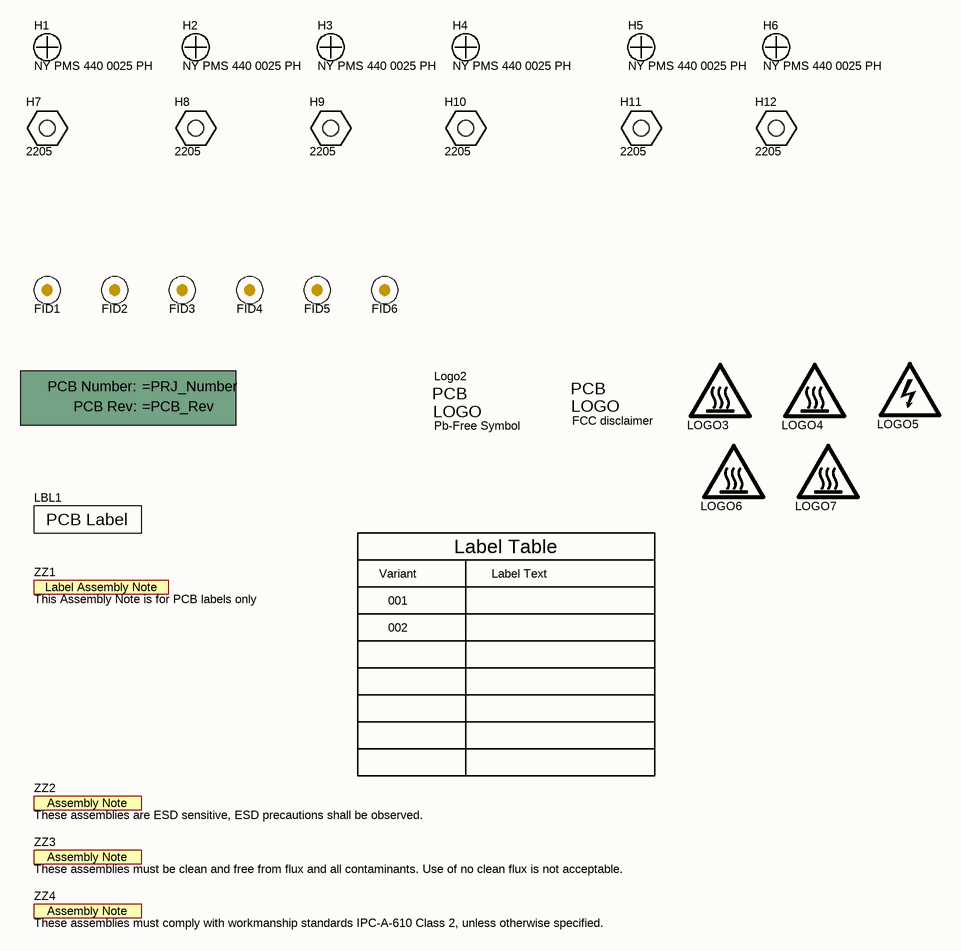
[diagram p9: LionIRVT-HW.SchDoc]

### Parts
!PCB1  Printed Circuit Board  (value not drawn)  (mechanical)
FID1  Fiducial  [Fiducial10-20]  (value not drawn)
FID2  Fiducial  [Fiducial10-20]  (value not drawn)
FID3  Fiducial  [Fiducial10-20]  (value not drawn)
FID4  Fiducial  [Fiducial10-20]  (value not drawn)
FID5  Fiducial  [Fiducial10-20]  (value not drawn)
FID6  Fiducial  [Fiducial10-20]  (value not drawn)
H1  NY PMS 440 0025 PH  [NY PMS 440 0025 PH]
H2  NY PMS 440 0025 PH  [NY PMS 440 0025 PH]
H3  NY PMS 440 0025 PH  [NY PMS 440 0025 PH]
H4  NY PMS 440 0025 PH  [NY PMS 440 0025 PH]
H5  NY PMS 440 0025 PH  [NY PMS 440 0025 PH]
H6  NY PMS 440 0025 PH  [NY PMS 440 0025 PH]
H7  2205  [KEYSTONE_2205]
H8  2205  [KEYSTONE_2205]
H9  2205  [KEYSTONE_2205]
H10  2205  [KEYSTONE_2205]
H11  2205  [KEYSTONE_2205]
H12  2205  [KEYSTONE_2205]
LBL1  (no value)  [Label_1250x250]
Logo1  FCC disclaimer  [FCC_disclaimer_stacked]  (no BOM)
Logo2  Pb-Free Symbol  [Pb-Free_Overlay_Medium]  (no BOM)
LOGO3  CAUTION HOT SURFACE  [IEC_HotSurface_Small]  (value not drawn)  (no BOM)
LOGO4  CAUTION HOT SURFACE  [IEC_HotSurface_Small]  (value not drawn)  (no BOM)
LOGO5  DANGER HIGH VOLTAGE  [IEC_HighVoltage_Small]  (value not drawn)  (no BOM)
LOGO6  CAUTION HOT SURFACE  [IEC_HotSurface_Small]  (value not drawn)  (no BOM)
LOGO7  CAUTION HOT SURFACE  [IEC_HotSurface_Small]  (value not drawn)  (no BOM)
ZZ1  This Assembly Note is for PCB labels only  [AssemblyNoteLabel]  (no BOM)
ZZ2  These assemblies are ESD sensitive, ESD precautions shall be observed.  [AssemblyNote]  (no BOM)
ZZ3  These assemblies must be clean and free from flux and all contaminants. Use of no clean flux is not acceptable.  [AssemblyNote]  (no BOM)
ZZ4  These assemblies must comply with workmanship standards IPC-A-610 Class 2, unless otherwise specified.  [AssemblyNote]  (no BOM)

### Notes on the sheet
- Label Table
- Variant
- 001
- 002
- Label Text
- (in symbol AssemblyNote) Assembly Note
- (in symbol AssemblyNoteLabel) Label Assembly Note
- (in symbol FCC_disclaimer) PCB; LOGO
- (in symbol Pb-Free) PCB; LOGO
- (in symbol PCB) PCB Number:; PCB Rev:
- (in symbol THT-13-457-10) PCB Label

### Library data of the parts
!PCB1 = PCB: Manufacturer: Any; SymbolCreator: a0412235; SymbolVersion: 2012-05-30; CompType: PCB; PartNumber: =PRJ_Number; RoHS: O; MountType: N/A; Publisher: Texas Instruments; LatestRevisionDate: 2012-06-27; LatestRevisionNote: Initial Version; Alternate Manufacturer: -; Alternate PartNumber: -
FID1-FID6 = Fiducial: Fiducial mark.  There is nothing to buy or mount.; SymbolCreator: codlsc; SymbolVersion: 2009-11-4; CompType: Fiducial; Publisher: Texas Instruments; LatestRevisionDate: 2014-08-01; LatestRevisionNote: Added Alternate PartNumber and Alternate Manufacturer parameters to appropriate components.; Manufacturer: N/A; MountType: N/A; PackageReference: Fiducial; PartNumber: N/A; ClassName: FiducialMark
H1-H6 = NY PMS 440 0025 PH: Machine Screw, Round, #4-40 x 1/4, Nylon, Philips panhead; Manufacturer: B&F Fastener Supply; CompType: Hardware; SymbolCreator: codlsc; U/M: EA; SymbolVersion: 2009-10-28; MountType: N/A; RoHS: Y; PartNumber: NY PMS 440 0025 PH; PackageReference: Screw; DigiKeyPartNumber: H542-ND; ComponentLink1Description: Datasheet Link; ComponentLink1URL: http://www.fasnetdirect.com/refguide/Machinepancombo.pdf; ClassName: Mounting Holes; Alternate Manufacturer: -; Alternate PartNumber: -; LatestRevisionDate: 2012-06-27; LatestRevisionNote: Initial Version; Publisher: Texas Instruments; Supplier 1: Digi-Key; Supplier Part Number 1: H542-ND
H7-H12 = 2205: Standoff, Hex, 1"L #4-40 Aluminum; Manufacturer: Keystone; SymbolCreator: a0412235; CompType: Standoff; MountType: N/A; RoHS: Y; PartNumber: 2205; PackageReference: 1" Aluminum Hex Standoff; ComponentLink1Description: Datasheet Link; ComponentLink1URL: http://www.keyelco.com/product-pdf.cfm?p=4279; LatestRevisionDate: 2014-11-19; Publisher: Texas Instruments; Supplier 1: Digi-Key; Supplier 2: Mouser; Supplier 3: Farnell; Supplier Part Number 1: 2205K-ND; Supplier Part Number 2: 534-2205; Supplier Part Number 3: 1785771; SymbolVersion: 2013-06-24
LBL1 = THT-13-457-10: Thermal Transfer Printable Labels, 1.250" W x 0.250" H - 10,000 per roll; Manufacturer: Brady; SymbolCreator: a0412235; CompType: Label; SymbolVersion: 2012-06-12; ClassName: Label; PartNumber: THT-13-457-10; RoHS: Y; PackageReference: PCB Label 1.25 x 0.250 inch; MountType: N/A; ComponentLink1Description: Web Page; ComponentLink1URL: http://www.bradyid.com/bradyid/pdpv/THT-13-457-10.html; Publisher: Texas Instruments; LatestRevisionDate: 2016-09-13; Supplier 1: Newark; Supplier Part Number 1: 04H3909
Logo1 = FCC_disclaimer: SymbolCreator: codlsc; SymbolVersion: 2011-08-22; Published: 2009-03-03; Publisher: Texas Instruments; LatestRevisionDate: 2014-11-20
Logo2 = Pb-Free: SymbolCreator: a0412235; SymbolVersion: 2011-08-22; Published: 2009-03-03; Publisher: Texas Instruments; LatestRevisionDate: 2016-03-21
LOGO3 LOGO4 LOGO6 LOGO7 = IEC_HotSurface: IEC 61010-1 Hot Surface Warning; SymbolCreator: a0412235; SymbolVersion: 2011-08-22; Published: 2009-03-03; Publisher: Texas Instruments; LatestRevisionDate: 2016-03-21
LOGO5 = IEC_HighVoltage: IEC 61010-1 High Voltage Warning; SymbolCreator: a0412235; SymbolVersion: 2011-08-22; Published: 2009-03-03; Publisher: Texas Instruments; LatestRevisionDate: 2016-03-21
ZZ1 = AssemblyNoteLabel: SymbolCreator: a0412235; SymbolVersion: 2012-06-14; CompType: AssemblyNote; ClassName: AssemblyNote; Publisher: Texas Instruments; LatestRevisionDate: 2012-07-31; LatestRevisionNote: Initial Version; Alternate Manufacturer: -; Alternate PartNumber: -
ZZ2-ZZ4 = AssemblyNote: SymbolCreator: codlsc; SymbolVersion: 2010-05-18; CompType: AssemblyNote; ClassName: AssemblyNote; Publisher: Texas Instruments; LatestRevisionDate: 2012-06-14; LatestRevisionNote: Initial Version; Alternate Manufacturer: -; Alternate PartNumber: -

## Nets that join several sheets
12VA: Battery_Slot_1 (C43A.1 C119A.1 C120A.2 C121A.2), Battery_Slot_2 (C43B.1 C119B.1 C120B.2 C121B.2), Battery_Slot_3 (C43C.1 C119C.1 C120C.2 C121C.2), Battery_Slot_4 (C43D.1 C119D.1 C120D.2 C121D.2)
+3.3v: LionIRVT-DAC (5 pins), Battery_Slot_1 (C30A.2 U19A.1), LionIRVT-ADC (5 pins), LionIRVT-SV601272A-Bias (C52.2 L2.2 U5.3), LionIRVT-TM4C_Main (21 pins), Battery_Slot_2 (C30B.2 U19B.1), Battery_Slot_3 (C30C.2 U19C.1), Battery_Slot_4 (C30D.2 U19D.1), LionIRVT-TM4C_Power (11 pins)
+5VA: LionIRVT-DAC (11 pins), Battery_Slot_1 (R38A.2 R87A.2), LionIRVT-ADC (26 pins), LionIRVT-SV601272A-Bias (C76.1 R10.1 R165.2 U7.5), Battery_Slot_2 (R38B.2 R87B.2), Battery_Slot_3 (R38C.2 R87C.2), Battery_Slot_4 (R38D.2 R87D.2)
+9VA: Battery_Slot_1 (9 pins), LionIRVT-SV601272A-Bias (5 pins), Battery_Slot_2 (9 pins), Battery_Slot_3 (9 pins), Battery_Slot_4 (9 pins)
-5V: Battery_Slot_1 (C47A.1 C122A.2 U6A.4), LionIRVT-SV601272A-Bias (J16.1), Battery_Slot_2 (C47B.1 C122B.2 U6B.4), Battery_Slot_3 (C47C.1 C122C.2 U6C.4), Battery_Slot_4 (C47D.1 C122D.2 U6D.4)
-5VA: Battery_Slot_1 (U8A.2), Battery_Slot_2 (U8B.2), Battery_Slot_3 (U8C.2), Battery_Slot_4 (U8D.2)
AGND: LionIRVT-DAC (37 pins), Battery_Slot_1 (33 pins), LionIRVT-ADC (61 pins), LionIRVT-SV601272A-Bias (19 pins), LionIRVT-TM4C_Main (NT5.1 U12.3), Battery_Slot_2 (33 pins), Battery_Slot_3 (33 pins), Battery_Slot_4 (33 pins), LionIRVT-TM4C_Power (14 pins)
GND: Battery_Slot_1 (C30A.1), Battery_Slot_2 (C30B.1), Battery_Slot_3 (C30C.1), Battery_Slot_4 (C30D.1)
PGND: Battery_Slot_1 (30 pins), LionIRVT-SV601272A-Bias (C38.2 C39.2 C40.2 C57.2), LionIRVT-Power (23 pins), Battery_Slot_2 (30 pins), Battery_Slot_3 (30 pins), Battery_Slot_4 (30 pins)
V_HV: Battery_Slot_1 (R35A.1), LionIRVT-SV601272A-Bias (9 pins), LionIRVT-Power (D6.1 L3.2), Battery_Slot_2 (R35B.1), Battery_Slot_3 (R35C.1), Battery_Slot_4 (R35D.1)
ADC.CS: LionIRVT-ADC (J19.6), LionIRVT-TM4C_Main (U12.20)
ADC.DONE: LionIRVT-ADC (J19.12), LionIRVT-TM4C_Main (U12.47)
ADC.DRDY: LionIRVT-ADC (J19.10), LionIRVT-TM4C_Main (U12.48)
ADC.MISO: LionIRVT-ADC (J19.2), LionIRVT-TM4C_Main (U12.22)
ADC.MOSI: LionIRVT-ADC (J19.4), LionIRVT-TM4C_Main (U12.21)
ADC.SCLK: LionIRVT-ADC (J19.8), LionIRVT-TM4C_Main (U12.19)
CHARGE.Enable: Battery_Slot_1 (R7A.1 R44A.1), LionIRVT-TM4C_Main (U12.64)
CHARGE.Enable: LionIRVT-TM4C_Main (U12.13), Battery_Slot_3 (R7C.1 R44C.1)
CHARGE.Enable: LionIRVT-TM4C_Main (U12.15), Battery_Slot_4 (R7D.1 R44D.1)
CHARGE.Enable: LionIRVT-TM4C_Main (U12.62), Battery_Slot_2 (R7B.1 R44B.1)
DAC.CS: LionIRVT-DAC (R14.2 U1.12), LionIRVT-TM4C_Main (U12.57)
DAC.MISO: LionIRVT-DAC (R15.2 U1.15), LionIRVT-TM4C_Main (U12.4)
DAC.MOSI: LionIRVT-DAC (R76.2 U1.14), LionIRVT-TM4C_Main (U12.1)
DAC.SCLK: LionIRVT-DAC (R78.2 U1.13), LionIRVT-TM4C_Main (U12.58)
FAULT: LionIRVT-TM4C_Main (U12.28), LionIRVT-Power (R26.1)
IBAT: LionIRVT-DAC (U16.8), LionIRVT-ADC (R48.1 R114.1)
IN_EN: LionIRVT-TM4C_Main (U12.5), LionIRVT-Power (U10.5)
IREF_VCOM: LionIRVT-DAC (C71.1 C116.1 R79.2 R80.2), Battery_Slot_1 (U6A.5), LionIRVT-ADC (R41.1 R112.1), Battery_Slot_2 (U6B.5), Battery_Slot_3 (U6C.5), Battery_Slot_4 (U6D.5)
ISet: LionIRVT-DAC (C22.1 L7.2 U35.3), Battery_Slot_1 (R77A.1)
ISet: LionIRVT-DAC (C28.1 L9.2 U35.5), Battery_Slot_2 (R77B.1)
ISet: LionIRVT-DAC (C123.1 L11.2 U36.3), Battery_Slot_3 (R77C.1)
ISet: LionIRVT-DAC (C127.1 L13.2 U36.5), Battery_Slot_4 (R77D.1)
LED.SDI: Battery_Slot_1 (U19A.2), Battery_Slot_2 (U19B.4)
LED.SDI: Battery_Slot_1 (U19A.4), LionIRVT-TM4C_Main (U12.10)
LED.SDI: Battery_Slot_2 (U19B.2), Battery_Slot_3 (U19C.4)
LED.SDI: Battery_Slot_3 (U19C.2), Battery_Slot_4 (U19D.4)
LED.SDO: LionIRVT-TM4C_Main (U12.53), Battery_Slot_4 (U19D.2)
MUX.IN.A0: LionIRVT-DAC (U16.1), LionIRVT-TM4C_Main (U12.29)
MUX.IN.A1: LionIRVT-DAC (U16.16), LionIRVT-TM4C_Main (U12.30)
MUX.IN.EN: LionIRVT-DAC (U16.2), LionIRVT-TM4C_Main (U12.31)
NetD10A_1: Battery_Slot_1 (D10A.1), LionIRVT-Power (Q7.3), Battery_Slot_2 (D10B.1), Battery_Slot_3 (D10C.1), Battery_Slot_4 (D10D.1)
OUTPUT.Enable: Battery_Slot_1 (U32A.5), LionIRVT-TM4C_Main (U12.63)
OUTPUT.Enable: LionIRVT-TM4C_Main (U12.14), Battery_Slot_3 (U32C.5)
OUTPUT.Enable: LionIRVT-TM4C_Main (U12.16), Battery_Slot_4 (U32D.5)
OUTPUT.Enable: LionIRVT-TM4C_Main (U12.61), Battery_Slot_2 (U32B.5)
SLOT.TEMP_1: LionIRVT-TM4C_Main (U12.9), LionIRVT-TM4C_Power (R45.1 U29.1)
SLOT.TEMP_2: LionIRVT-TM4C_Main (U12.8), LionIRVT-TM4C_Power (R108.1 U29.7)
SLOT.TEMP_3: LionIRVT-TM4C_Main (U12.7), LionIRVT-TM4C_Power (R143.1 U29.8)
SLOT.TEMP_4: LionIRVT-TM4C_Main (U12.6), LionIRVT-TM4C_Power (R141.1 U29.14)
VBAT: LionIRVT-DAC (U16.9), LionIRVT-ADC (R56.1 R129.1)
VSense: LionIRVT-DAC (U16.10), Battery_Slot_4 (C100D.1 R173D.2)
VSense: LionIRVT-DAC (U16.11), Battery_Slot_3 (C100C.1 R173C.2)
VSense: LionIRVT-DAC (U16.12), Battery_Slot_2 (C100B.1 R173B.2)
VSense: LionIRVT-DAC (U16.13), Battery_Slot_1 (C100A.1 R173A.2)
VSet: LionIRVT-DAC (C16.2 L6.2 U35.1), Battery_Slot_1 (R93A.1)
VSet: LionIRVT-DAC (C26.2 L8.2 U35.4), Battery_Slot_2 (R93B.1)
VSet: LionIRVT-DAC (C44.2 L10.2 U36.1), Battery_Slot_3 (R93C.1)
VSet: LionIRVT-DAC (C126.2 L12.2 U36.4), Battery_Slot_4 (R93D.1)